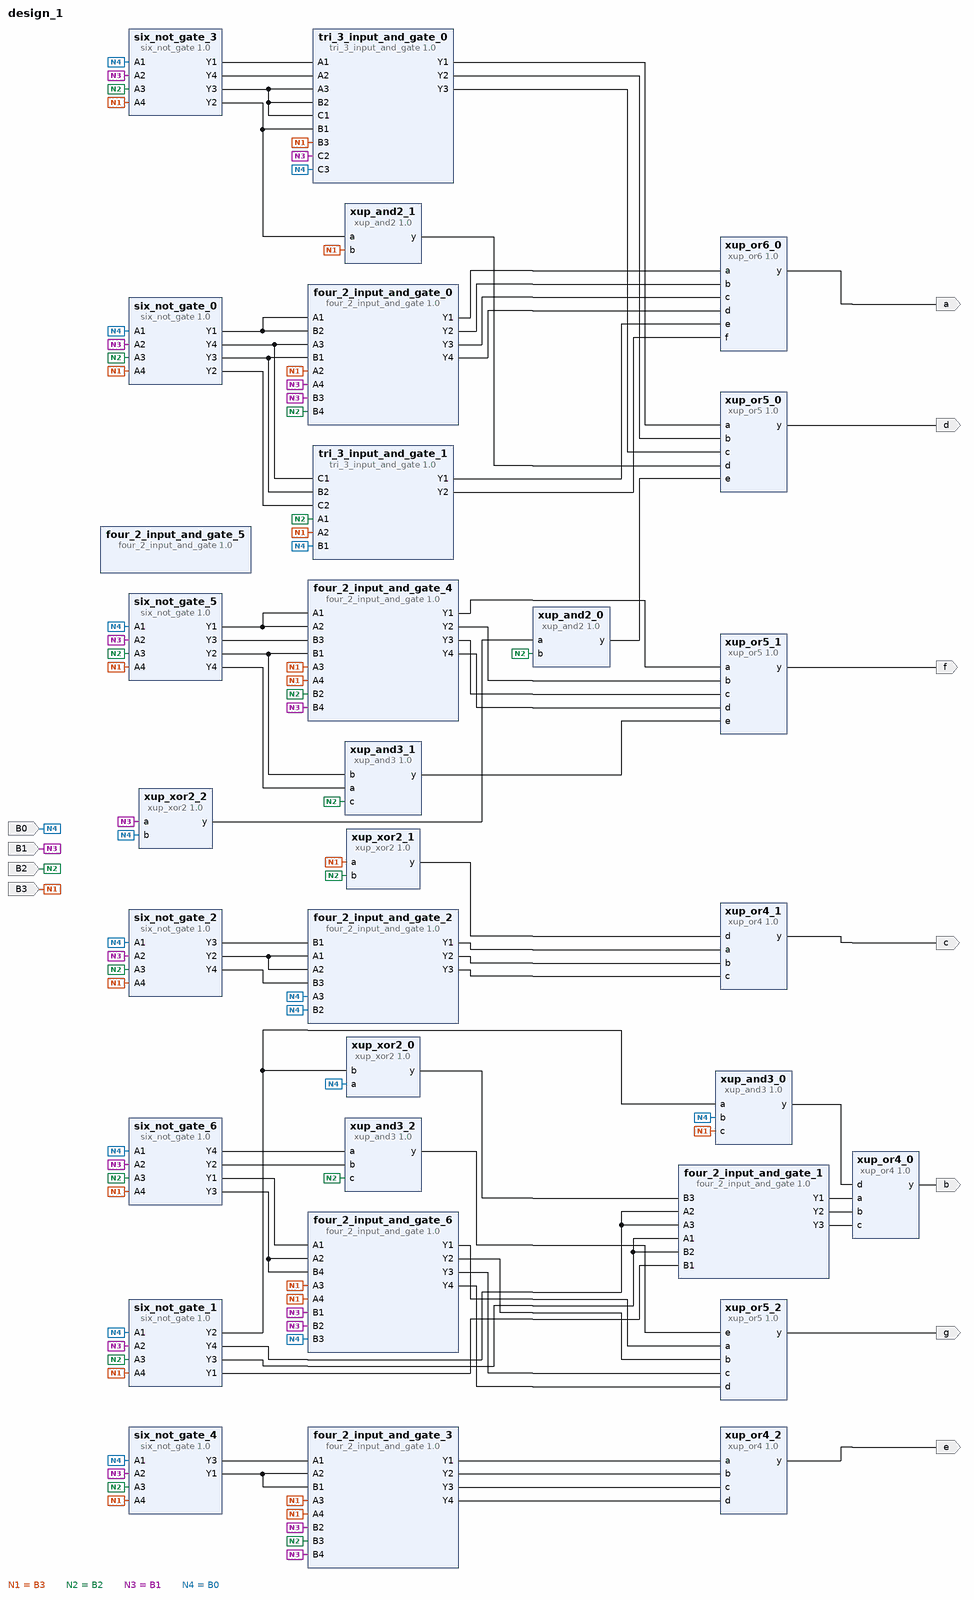
[diagram p0: block diagram of the top level]
# Vivado block design design_1, Vivado 2015.4
create_bd_design design_1

create_bd_port -dir I B3
create_bd_port -dir I B2
create_bd_port -dir I B1
create_bd_port -dir I B0
create_bd_port -dir O b
create_bd_port -dir O a
create_bd_port -dir O c
create_bd_port -dir O d
create_bd_port -dir O e
create_bd_port -dir O f
create_bd_port -dir O g

create_bd_cell -type ip -vlnv xilinx.com:XUP:six_not_gate:1.0 six_not_gate_0
create_bd_cell -type ip -vlnv xilinx.com:XUP:four_2_input_and_gate:1.0 four_2_input_and_gate_0
create_bd_cell -type ip -vlnv xilinx.com:XUP:tri_3_input_and_gate:1.0 tri_3_input_and_gate_1
create_bd_cell -type ip -vlnv xilinx.com:xup:xup_or6:1.0 xup_or6_0
create_bd_cell -type ip -vlnv xilinx.com:xup:xup_xor2:1.0 xup_xor2_0
create_bd_cell -type ip -vlnv xilinx.com:XUP:six_not_gate:1.0 six_not_gate_1
create_bd_cell -type ip -vlnv xilinx.com:XUP:four_2_input_and_gate:1.0 four_2_input_and_gate_1
create_bd_cell -type ip -vlnv xilinx.com:xup:xup_and3:1.0 xup_and3_0
create_bd_cell -type ip -vlnv xilinx.com:xup:xup_or4:1.0 xup_or4_0
create_bd_cell -type ip -vlnv xilinx.com:xup:xup_xor2:1.0 xup_xor2_1
create_bd_cell -type ip -vlnv xilinx.com:XUP:six_not_gate:1.0 six_not_gate_2
create_bd_cell -type ip -vlnv xilinx.com:xup:xup_or4:1.0 xup_or4_1
create_bd_cell -type ip -vlnv xilinx.com:XUP:four_2_input_and_gate:1.0 four_2_input_and_gate_2
create_bd_cell -type ip -vlnv xilinx.com:XUP:six_not_gate:1.0 six_not_gate_3
create_bd_cell -type ip -vlnv xilinx.com:xup:xup_xor2:1.0 xup_xor2_2
create_bd_cell -type ip -vlnv xilinx.com:XUP:tri_3_input_and_gate:1.0 tri_3_input_and_gate_0
create_bd_cell -type ip -vlnv xilinx.com:xup:xup_and2:1.0 xup_and2_0
create_bd_cell -type ip -vlnv xilinx.com:xup:xup_or5:1.0 xup_or5_0
create_bd_cell -type ip -vlnv xilinx.com:xup:xup_and2:1.0 xup_and2_1
create_bd_cell -type ip -vlnv xilinx.com:XUP:six_not_gate:1.0 six_not_gate_4
create_bd_cell -type ip -vlnv xilinx.com:XUP:four_2_input_and_gate:1.0 four_2_input_and_gate_3
create_bd_cell -type ip -vlnv xilinx.com:xup:xup_or4:1.0 xup_or4_2
create_bd_cell -type ip -vlnv xilinx.com:XUP:six_not_gate:1.0 six_not_gate_5
create_bd_cell -type ip -vlnv xilinx.com:XUP:four_2_input_and_gate:1.0 four_2_input_and_gate_4
create_bd_cell -type ip -vlnv xilinx.com:xup:xup_or5:1.0 xup_or5_1
create_bd_cell -type ip -vlnv xilinx.com:xup:xup_and3:1.0 xup_and3_1
create_bd_cell -type ip -vlnv xilinx.com:XUP:six_not_gate:1.0 six_not_gate_6
create_bd_cell -type ip -vlnv xilinx.com:XUP:four_2_input_and_gate:1.0 four_2_input_and_gate_5
create_bd_cell -type ip -vlnv xilinx.com:xup:xup_and3:1.0 xup_and3_2
create_bd_cell -type ip -vlnv xilinx.com:xup:xup_or5:1.0 xup_or5_2
create_bd_cell -type ip -vlnv xilinx.com:XUP:four_2_input_and_gate:1.0 four_2_input_and_gate_6

# ---- connections ----

connect_bd_net -net A4_1 [get_bd_ports B3] \
  [get_bd_pins six_not_gate_0/A4] [get_bd_pins four_2_input_and_gate_0/A2] [get_bd_pins tri_3_input_and_gate_1/A2] \
  [get_bd_pins six_not_gate_1/A4] [get_bd_pins xup_and3_0/c] [get_bd_pins six_not_gate_2/A4] [get_bd_pins xup_xor2_1/a] \
  [get_bd_pins six_not_gate_3/A4] [get_bd_pins xup_and2_1/b] [get_bd_pins tri_3_input_and_gate_0/B3] \
  [get_bd_pins six_not_gate_4/A4] [get_bd_pins four_2_input_and_gate_3/A3] [get_bd_pins four_2_input_and_gate_3/A4] \
  [get_bd_pins six_not_gate_5/A4] [get_bd_pins four_2_input_and_gate_4/A3] [get_bd_pins four_2_input_and_gate_4/A4] \
  [get_bd_pins six_not_gate_6/A4] [get_bd_pins four_2_input_and_gate_6/A3] [get_bd_pins four_2_input_and_gate_6/A4]
connect_bd_net -net A3_1 [get_bd_ports B2] \
  [get_bd_pins six_not_gate_0/A3] [get_bd_pins four_2_input_and_gate_0/B4] [get_bd_pins tri_3_input_and_gate_1/A1] \
  [get_bd_pins six_not_gate_1/A3] [get_bd_pins six_not_gate_2/A3] [get_bd_pins xup_xor2_1/b] [get_bd_pins six_not_gate_3/A3] \
  [get_bd_pins xup_and2_0/b] [get_bd_pins six_not_gate_4/A3] [get_bd_pins four_2_input_and_gate_3/B3] \
  [get_bd_pins six_not_gate_5/A3] [get_bd_pins xup_and3_1/c] [get_bd_pins four_2_input_and_gate_4/B2] \
  [get_bd_pins six_not_gate_6/A3] [get_bd_pins xup_and3_2/c]
connect_bd_net -net A2_1 [get_bd_ports B1] \
  [get_bd_pins six_not_gate_0/A2] [get_bd_pins four_2_input_and_gate_0/B3] [get_bd_pins four_2_input_and_gate_0/A4] \
  [get_bd_pins six_not_gate_1/A2] [get_bd_pins six_not_gate_2/A2] [get_bd_pins six_not_gate_3/A2] [get_bd_pins xup_xor2_2/a] \
  [get_bd_pins tri_3_input_and_gate_0/C2] [get_bd_pins six_not_gate_4/A2] [get_bd_pins four_2_input_and_gate_3/B2] \
  [get_bd_pins four_2_input_and_gate_3/B4] [get_bd_pins six_not_gate_5/A2] [get_bd_pins four_2_input_and_gate_4/B4] \
  [get_bd_pins six_not_gate_6/A2] [get_bd_pins four_2_input_and_gate_6/B1] [get_bd_pins four_2_input_and_gate_6/B2]
connect_bd_net -net B0_1 [get_bd_ports B0] \
  [get_bd_pins six_not_gate_0/A1] [get_bd_pins tri_3_input_and_gate_1/B1] [get_bd_pins six_not_gate_1/A1] \
  [get_bd_pins xup_xor2_0/a] [get_bd_pins xup_and3_0/b] [get_bd_pins six_not_gate_2/A1] \
  [get_bd_pins four_2_input_and_gate_2/B2] [get_bd_pins four_2_input_and_gate_2/A3] [get_bd_pins six_not_gate_3/A1] \
  [get_bd_pins xup_xor2_2/b] [get_bd_pins tri_3_input_and_gate_0/C3] [get_bd_pins six_not_gate_4/A1] \
  [get_bd_pins six_not_gate_5/A1] [get_bd_pins six_not_gate_6/A1] [get_bd_pins four_2_input_and_gate_6/B3]
connect_bd_net [get_bd_pins six_not_gate_0/Y1] [get_bd_pins four_2_input_and_gate_0/A1] [get_bd_pins four_2_input_and_gate_0/B2]
connect_bd_net [get_bd_pins six_not_gate_0/Y4] [get_bd_pins four_2_input_and_gate_0/A3] [get_bd_pins tri_3_input_and_gate_1/C1]
connect_bd_net [get_bd_pins six_not_gate_0/Y3] [get_bd_pins four_2_input_and_gate_0/B1] [get_bd_pins tri_3_input_and_gate_1/B2]
connect_bd_net [get_bd_pins six_not_gate_0/Y2] [get_bd_pins tri_3_input_and_gate_1/C2]
connect_bd_net [get_bd_pins four_2_input_and_gate_0/Y1] [get_bd_pins xup_or6_0/a]
connect_bd_net [get_bd_pins four_2_input_and_gate_0/Y2] [get_bd_pins xup_or6_0/b]
connect_bd_net [get_bd_pins four_2_input_and_gate_0/Y3] [get_bd_pins xup_or6_0/c]
connect_bd_net [get_bd_pins four_2_input_and_gate_0/Y4] [get_bd_pins xup_or6_0/d]
connect_bd_net [get_bd_pins tri_3_input_and_gate_1/Y1] [get_bd_pins xup_or6_0/e]
connect_bd_net [get_bd_pins tri_3_input_and_gate_1/Y2] [get_bd_pins xup_or6_0/f]
connect_bd_net [get_bd_pins six_not_gate_1/Y2] [get_bd_pins xup_xor2_0/b] [get_bd_pins xup_and3_0/a]
connect_bd_net [get_bd_pins xup_xor2_0/y] [get_bd_pins four_2_input_and_gate_1/B3]
connect_bd_net [get_bd_pins six_not_gate_1/Y4] [get_bd_pins four_2_input_and_gate_1/A3] [get_bd_pins four_2_input_and_gate_1/A2]
connect_bd_net [get_bd_pins six_not_gate_1/Y3] [get_bd_pins four_2_input_and_gate_1/A1] [get_bd_pins four_2_input_and_gate_1/B2]
connect_bd_net [get_bd_pins six_not_gate_1/Y1] [get_bd_pins four_2_input_and_gate_1/B1]
connect_bd_net [get_bd_pins four_2_input_and_gate_1/Y1] [get_bd_pins xup_or4_0/a]
connect_bd_net [get_bd_pins four_2_input_and_gate_1/Y2] [get_bd_pins xup_or4_0/b]
connect_bd_net [get_bd_pins four_2_input_and_gate_1/Y3] [get_bd_pins xup_or4_0/c]
connect_bd_net [get_bd_pins xup_and3_0/y] [get_bd_pins xup_or4_0/d]
connect_bd_net [get_bd_pins xup_or4_0/y] [get_bd_ports b]
connect_bd_net [get_bd_pins xup_or6_0/y] [get_bd_ports a]
connect_bd_net [get_bd_pins xup_xor2_1/y] [get_bd_pins xup_or4_1/d]
connect_bd_net [get_bd_pins six_not_gate_2/Y3] [get_bd_pins four_2_input_and_gate_2/B1]
connect_bd_net [get_bd_pins six_not_gate_2/Y2] [get_bd_pins four_2_input_and_gate_2/A1] [get_bd_pins four_2_input_and_gate_2/A2]
connect_bd_net [get_bd_pins six_not_gate_2/Y4] [get_bd_pins four_2_input_and_gate_2/B3]
connect_bd_net [get_bd_pins four_2_input_and_gate_2/Y1] [get_bd_pins xup_or4_1/a]
connect_bd_net [get_bd_pins four_2_input_and_gate_2/Y2] [get_bd_pins xup_or4_1/b]
connect_bd_net [get_bd_pins four_2_input_and_gate_2/Y3] [get_bd_pins xup_or4_1/c]
connect_bd_net [get_bd_pins xup_or4_1/y] [get_bd_ports c]
connect_bd_net [get_bd_pins xup_xor2_2/y] [get_bd_pins xup_and2_0/a]
connect_bd_net [get_bd_pins xup_and2_0/y] [get_bd_pins xup_or5_0/e]
connect_bd_net [get_bd_pins tri_3_input_and_gate_0/Y1] [get_bd_pins xup_or5_0/a]
connect_bd_net [get_bd_pins tri_3_input_and_gate_0/Y2] [get_bd_pins xup_or5_0/b]
connect_bd_net [get_bd_pins tri_3_input_and_gate_0/Y3] [get_bd_pins xup_or5_0/c]
connect_bd_net [get_bd_pins xup_or5_0/y] [get_bd_ports d]
connect_bd_net [get_bd_pins xup_and2_1/y] [get_bd_pins xup_or5_0/d]
connect_bd_net [get_bd_pins six_not_gate_3/Y2] [get_bd_pins xup_and2_1/a] [get_bd_pins tri_3_input_and_gate_0/B1]
connect_bd_net [get_bd_pins six_not_gate_3/Y1] [get_bd_pins tri_3_input_and_gate_0/A1]
connect_bd_net [get_bd_pins six_not_gate_3/Y4] [get_bd_pins tri_3_input_and_gate_0/A2]
connect_bd_net [get_bd_pins six_not_gate_3/Y3] \
  [get_bd_pins tri_3_input_and_gate_0/C1] [get_bd_pins tri_3_input_and_gate_0/B2] [get_bd_pins tri_3_input_and_gate_0/A3]
connect_bd_net [get_bd_pins four_2_input_and_gate_3/Y1] [get_bd_pins xup_or4_2/a]
connect_bd_net [get_bd_pins four_2_input_and_gate_3/Y2] [get_bd_pins xup_or4_2/b]
connect_bd_net [get_bd_pins four_2_input_and_gate_3/Y3] [get_bd_pins xup_or4_2/c]
connect_bd_net [get_bd_pins four_2_input_and_gate_3/Y4] [get_bd_pins xup_or4_2/d]
connect_bd_net [get_bd_pins xup_or4_2/y] [get_bd_ports e]
connect_bd_net [get_bd_pins six_not_gate_4/Y3] [get_bd_pins four_2_input_and_gate_3/A1]
connect_bd_net [get_bd_pins six_not_gate_4/Y1] [get_bd_pins four_2_input_and_gate_3/B1] [get_bd_pins four_2_input_and_gate_3/A2]
connect_bd_net [get_bd_pins four_2_input_and_gate_4/Y1] [get_bd_pins xup_or5_1/a]
connect_bd_net [get_bd_pins four_2_input_and_gate_4/Y2] [get_bd_pins xup_or5_1/b]
connect_bd_net [get_bd_pins four_2_input_and_gate_4/Y3] [get_bd_pins xup_or5_1/c]
connect_bd_net [get_bd_pins four_2_input_and_gate_4/Y4] [get_bd_pins xup_or5_1/d]
connect_bd_net [get_bd_pins xup_or5_1/y] [get_bd_ports f]
connect_bd_net [get_bd_pins xup_and3_1/y] [get_bd_pins xup_or5_1/e]
connect_bd_net [get_bd_pins six_not_gate_5/Y4] [get_bd_pins xup_and3_1/a]
connect_bd_net [get_bd_pins six_not_gate_5/Y2] [get_bd_pins xup_and3_1/b] [get_bd_pins four_2_input_and_gate_4/B1]
connect_bd_net [get_bd_pins six_not_gate_5/Y1] [get_bd_pins four_2_input_and_gate_4/A1] [get_bd_pins four_2_input_and_gate_4/A2]
connect_bd_net [get_bd_pins six_not_gate_5/Y3] [get_bd_pins four_2_input_and_gate_4/B3]
connect_bd_net [get_bd_pins xup_and3_2/y] [get_bd_pins xup_or5_2/e]
connect_bd_net [get_bd_pins xup_or5_2/y] [get_bd_ports g]
connect_bd_net [get_bd_pins four_2_input_and_gate_6/Y1] [get_bd_pins xup_or5_2/a]
connect_bd_net [get_bd_pins four_2_input_and_gate_6/Y2] [get_bd_pins xup_or5_2/b]
connect_bd_net [get_bd_pins four_2_input_and_gate_6/Y3] [get_bd_pins xup_or5_2/c]
connect_bd_net [get_bd_pins four_2_input_and_gate_6/Y4] [get_bd_pins xup_or5_2/d]
connect_bd_net [get_bd_pins six_not_gate_6/Y1] [get_bd_pins four_2_input_and_gate_6/A1]
connect_bd_net [get_bd_pins six_not_gate_6/Y3] [get_bd_pins four_2_input_and_gate_6/A2] [get_bd_pins four_2_input_and_gate_6/B4]
connect_bd_net [get_bd_pins six_not_gate_6/Y4] [get_bd_pins xup_and3_2/a]
connect_bd_net [get_bd_pins six_not_gate_6/Y2] [get_bd_pins xup_and3_2/b]

validate_bd_design
save_bd_design
